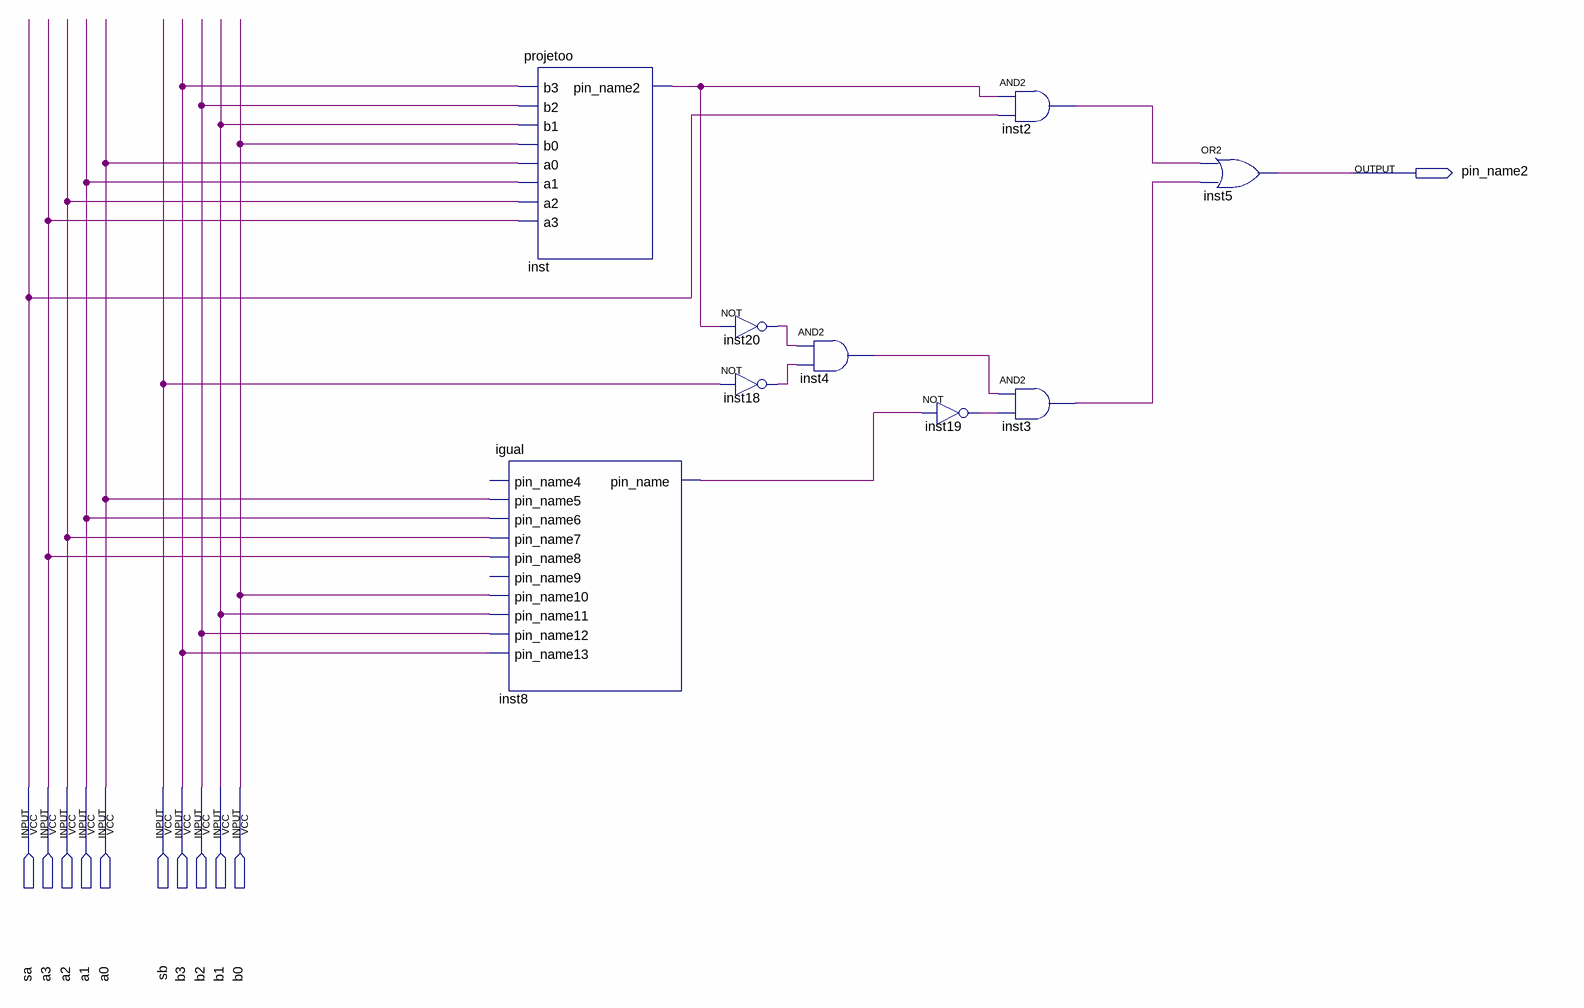
[diagram p0: schematic sheet]
// Quartus schematic funcao_maiorque.bdf as structural Verilog: 9 symbols, 11 pins
module funcao_maiorque (
  input  sa,
  input  a3,
  input  a2,
  input  a1,
  input  a0,
  input  sb,
  input  b3,
  input  b2,
  input  b1,
  input  b0,
  output pin_name2
);

  wire inst2_out, inst3_out, inst4_out, inst8_pin_name, inst18_out, inst19_out, inst20_out, inst_pin_name2;

  projetoo inst (.b3(b3), .b2(b2), .b1(b1), .b0(b0), .a0(a0), .a1(a1), .a2(a2), .a3(a3), .pin_name2(inst_pin_name2));
  igual inst8 (
    .pin_name5(a0), .pin_name6(a1), .pin_name7(a2), .pin_name8(a3), .pin_name10(b0), .pin_name11(b1),
    .pin_name12(b2), .pin_name13(b3), .pin_name(inst8_pin_name));  // open: pin_name4, pin_name9
  not inst20 (inst20_out, inst_pin_name2);
  not inst18 (inst18_out, sb);
  and inst4 (inst4_out, inst20_out, inst18_out);
  not inst19 (inst19_out, inst8_pin_name);
  and inst2 (inst2_out, inst_pin_name2, sa);
  and inst3 (inst3_out, inst4_out, inst19_out);
  or inst5 (pin_name2, inst2_out, inst3_out);
endmodule
